# EAGLE design TurquoiseBicuspid (EAGLE 6.5.0)
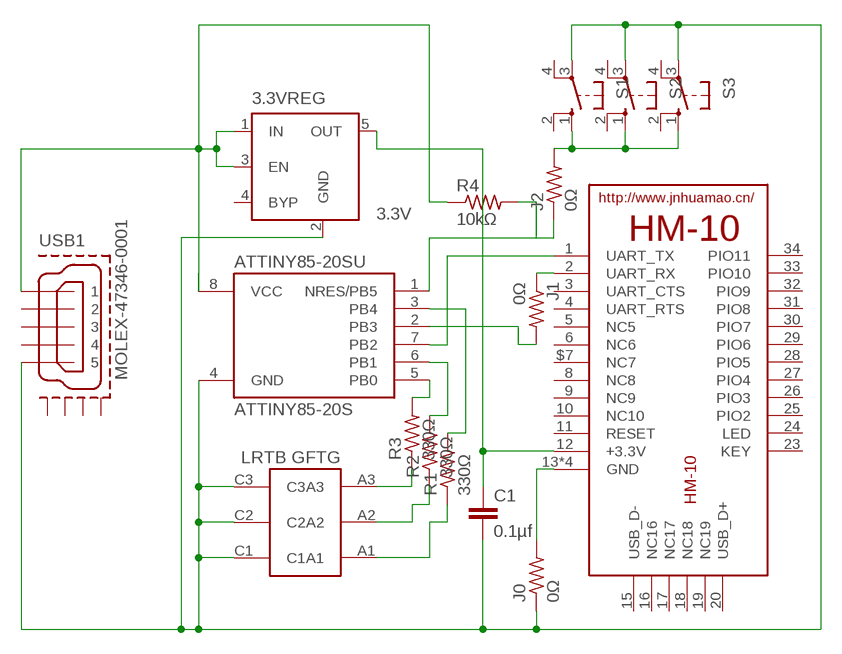
[diagram p0: schematic, sheet 1]

## Parts
3.3VREG  3.3V  MIC5219XX  [SOT23-5]
ATTINY85-20SU  ATTINY85-20S  [SOIC8_EIAJ_208MIL]
C1  0.1µf  C-EUC1206  [C1206]
HM-10  HM-10-BOARD  [26.9X13X2.2_BOARD]
J0  0Ω  R-US_R1206  [R1206]
J1  0Ω  R-US_R1206  [R1206]
J2  0Ω  R-US_R1206  [R1206]
R1  330Ω  R-US_M1206  [M1206]
R2  330Ω  R-US_M1206  [M1206]
R3  330Ω  R-US_M1206  [M1206]
R4  10kΩ  R-US_R1206  [R1206]
S1  10-XX  [B3F-10XX]
S2  10-XX  [B3F-10XX]
S3  10-XX  [B3F-10XX]
U$1  LRTB_GFTG  [LRTB_GFTG]
USB1  MOLEX-47346-0001  [MOLEX-47364-0001]

## Nets
3.3V: 3.3VREG.5(OUT) C1.1 HM-10.12(+3.3V)
5V: 3.3VREG.1(IN) 3.3VREG.3(EN) ATTINY85-20SU.8(VCC) R4.1 USB1.1
A1: ATTINY85-20SU.3(PB4) R1.1 R1.2 U$1.A1
A2: ATTINY85-20SU.6(PB1) R2.1 R2.2 U$1.A2
A3: ATTINY85-20SU.5(PB0) R3.1 R3.2 U$1.A3
BT_RX: ATTINY85-20SU.2(PB3) HM-10.2(UART_RX) J1.1 J1.2
BT_TX: ATTINY85-20SU.7(PB2) HM-10.1(UART_TX)
GND: 3.3VREG.2(GND) ATTINY85-20SU.4(GND) C1.2 J0.1 S1.3(P) S2.3(P) S3.3(P) U$1.C1 U$1.C2 U$1.C3 USB1.5
N$6: HM-10.13(GND) HM-10.14(GND) HM-10.21(GND) HM-10.22(GND) J0.2
RESET: ATTINY85-20SU.1(NRES/PB5) J2.1 J2.2 R4.2 S1.1(S) S2.1(S) S3.1(S)
Unconnected: 3.3VREG.4(BYP) HM-10.3(UART_CTS) HM-10.4(UART_RTS) HM-10.5(NC5) HM-10.6(NC6) HM-10.8(NC8) HM-10.9(NC9) HM-10.10(NC10) HM-10.11(RESET) HM-10.15(USB_D-) HM-10.16(NC16) HM-10.17(NC17) HM-10.18(NC18) HM-10.19(NC19) HM-10.20(USB_D+) HM-10.23(KEY) HM-10.24(LED) HM-10.25(PIO2) HM-10.26(PIO3) HM-10.27(PIO4) HM-10.28(PIO5) HM-10.29(PIO6) HM-10.30(PIO7) HM-10.31(PIO8) HM-10.32(PIO9) HM-10.33(PIO10) HM-10.34(PIO11) HM-10.$7(NC7) S1.2(S1) S1.4(P1) S2.2(S1) S2.4(P1) S3.2(S1) S3.4(P1) USB1.2 USB1.3 USB1.4 USB1.GND1 USB1.GND2 USB1.GND3 USB1.GND4

## Library data of the parts
3.3VREG = v-reg-micrel:MIC5219XX: VOLTAGE REGULATOR; OC_FARNELL: unknown; OC_NEWARK: unknown
ATTINY85-20SU = _hhn_attiny25_45_85:ATTINY85*: ATMEL ATtiny 85 Packages: P = PDIP 08 30mil S = SOIC 08 EIAJ 208mil Technologies Note: for complete ordering code (temp. range, finish, tape&reel etc.) see www.atmel.com • Supply Voltage: V = (1.8…5.5)V | [blank] = (2.7…5.5)V • Speed: 10 = 10 MHz | 20 = 20 MHz Author: Dipl.-Ing. FH Rainer Bayer HHN Hochschule Heilbronn (Heilbronn University), rainer.bayer@hs-heilbronn.de Ingenieurbüro ing-rb, mail@ing-rb.de
C1 = rcl:C-EU: CAPACITOR, European symbol
HM-10 = JNHuaMao:HM-10: HM Bluetooth module use TI CC2540 or CC2541, Master and slave roles in one, transmission version and remote control version and PIO state acquisition functions in one, Support the AT command modify module parameters, Convenient and flexible.
J0 J1 J2 R1-R4 = rcl:R-US_: RESISTOR, American symbol
S1-S3 = switch-omron:10-XX: OMRON SWITCH; MPN: B3F-1000; OC_FARNELL: 176432; OC_NEWARK: 36M3542
U$1 = osram_led:LRTB_GFTG
USB1 = usb_con-update:MOLEX-47346-0001: MICRO USB B, BOTTOM MOUNT

## Board
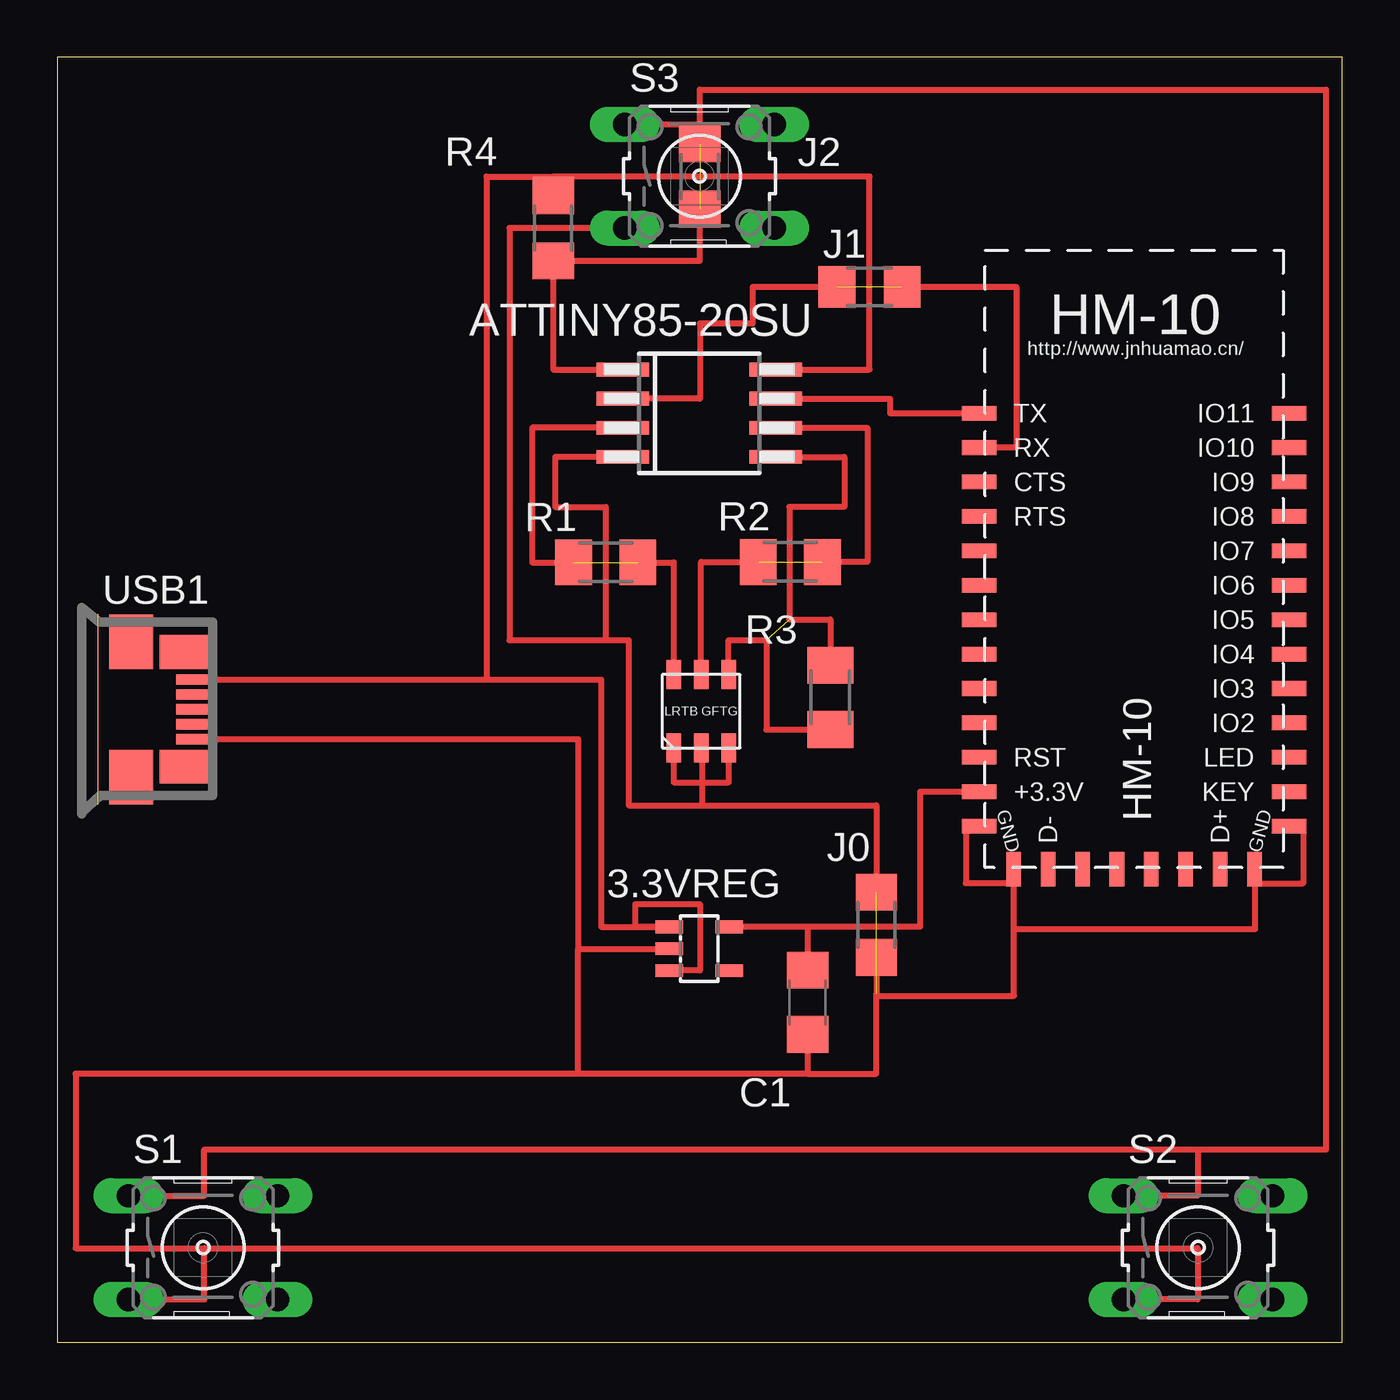
[diagram p1: board, top side]

Size 56 x 56 mm. Coordinates in mm from the lower left corner, seen from the top.
Outline: 0,0 56,0 56,56 0,56 0,0
Copper layers (1*16): Top 0.035mm / dielectric 1.5mm / Bottom 0.035mm
Design rules "default": minimum track width 10mil, minimum drill 24mil, track to track 8mil, track to pad 8mil, pad to pad 8mil, via to via 8mil, smd to smd 8mil, copper to edge 40mil, drill to drill 8mil, minimum pad ring 10mil, minimum via ring 8mil, stop-mask expansion 4mil, vias tented up to drill 0mil, thermal gap 10mil

### Footprints (pad centres in the part's own frame; a part is rotated, then mirrored left to right if it is on the bottom)
SOT23-5 = smd 0.55 x 1.2: 1 -0.95,-1.3; 2 0,-1.3; 3 0.95,-1.3; 4 0.95,1.3; 5 -0.95,1.3
SOIC8_EIAJ_208MIL = smd 0.6 x 2.286: 1 -1.905,-3.33; 2 -0.635,-3.33; 3 0.635,-3.33; 4 1.905,-3.33; 5 1.905,3.33; 6 0.635,3.33; 7 -0.635,3.33; 8 -1.905,3.33
C1206 = smd 1.6 x 1.8: 1 -1.4,0; 2 1.4,0
26.9X13X2.2_BOARD = smd 1.5 x 0.635: 1 -7.5,0; 2 -7.5,-1.5; 3 -7.5,-3; 4 -7.5,-4.5; 5 -7.5,-6; 6 -7.5,-7.5; 8 -7.5,-10.5; 9 -7.5,-12; 10 -7.5,-13.5; 11 -7.5,-15; 12 -7.5,-16.5; 13 -7.5,-18; 22 6,-18; 23 6,-16.5; 24 6,-15; 25 6,-13.5; 26 6,-12; 27 6,-10.5; 28 6,-9; 29 6,-7.5; 30 6,-6; 31 6,-4.5; 32 6,-3; 33 6,-1.5; 34 6,0; $7 -7.5,-9 | smd 0.635 x 1.5: 14 -6,-19.875; 15 -4.5,-19.875; 16 -3,-19.875; 17 -1.5,-19.875; 18 0,-19.875; 19 1.5,-19.875; 20 3,-19.875; 21 4.5,-19.875
R1206 = smd 1.6 x 1.803: 1 -1.422,0; 2 1.422,0
M1206 = smd 1.6 x 2: 1 -1.4,0; 2 1.4,0
B3F-10XX = drill 1.016 long: 1 -3.251,2.261; 2 3.251,2.261; 3 -3.251,-2.261; 4 3.251,-2.261
LRTB_GFTG = smd 0.635 x 1.27: A1 0.5,0; A2 1.7,0; A3 2.9,0; C1 0.5,-3.2; C2 1.7,-3.2; C3 2.9,-3.2
MOLEX-47364-0001 = smd 1.7 x 0.45: 1 2.8,1.3; 2 2.8,0.65; 3 2.8,0; 4 2.8,-0.65; 5 2.8,-1.3 | smd 1.9 x 2.375: GND1 0,2.95; GND4 0,-2.95 | smd 2.1 x 1.475: GND2 2.3,2.5; GND3 2.3,-2.5

### Placement (x,y rotation side)
3.3VREG  27.98,17.15 270 top
ATTINY85-20SU  27.98,40.49 270 top
C1  32.7,14.81 270 top
HM-10  47.68,40.49 0 top
J0  35.7,18.19 270 top
J1  35.4,46 180 top
J2  28,50.8 90 top
R1  23.9,33.99 180 top
R2  31.95,34.01 0 top
R3  33.69,28.1 90 top
R4  21.61,48.55 270 top
S1  6.35,4.12 0 top
S2  49.72,4.12 0 top
S3  27.99,50.82 0 top
U$1  26.36,29.1 0 top
USB1  3.22,27.58 0 top

### Tracks (layer width: path | path; a pad name or v marks a point on that pad's centre or on a via)
3.3V
  Top 0.254: 3.3VREG.5 32.7,18.1 32.7,18.11 | 32.7,18.11 C1.1 | HM-10.12 37.6,23.99 37.6,18.11 32.7,18.11
5V
  Top 0.254: USB1.1 18.7,28.88 | 18.7,28.88 23.7,28.88 23.7,18.1 3.3VREG.1 25.2,18.1 25.2,19.1 28,19.1 28,16.2 3.3VREG.3 | ATTINY85-20SU.8 35.4,42.4 35.4,50.8 21.7,50.8 21.61,50.8 | 18.7,28.88 18.7,50.8 21.61,50.8 | 21.61,50.8 R4.1
A1  (1 unrouted)
  Top 0.254: R1.1 26.86,33.99 U$1.A1 | ATTINY85-20SU.3 20.7,39.85 20.7,33.99 R1.2
A2  (1 unrouted)
  Top 0.254: ATTINY85-20SU.6 35.3,39.85 35.3,34.01 R2.2 | U$1.A2 28.06,34.01 R2.1
A3  (1 unrouted)
  Top 0.254: ATTINY85-20SU.5 34.3,38.59 34.3,36.4 31.9,36.4 31.9,31.5 33.69,31.5 R3.2 | U$1.A3 29.26,30.6 30.9,30.6 30.9,26.7 R3.1
BT_RX  (1 unrouted)
  Top 0.254: ATTINY85-20SU.2 28,41.12 28,44.4 30.3,44.4 30.3,46 J1.2 | J1.1 41.8,46 41.8,38.99 HM-10.2
BT_TX
  Top 0.254: ATTINY85-20SU.7 36.3,41.12 36.3,40.49 HM-10.1
GND  (2 unrouted)
  Top 0.254: S1.3 6.4,1.86 6.4,4.1 | 6.4,4.1 49.7,4.1 49.7,1.86 S2.3 | USB1.5 22.7,26.28 22.7,17.15 | 22.7,17.15 3.3VREG.2 | U$1.C1 26.86,24.4 29.26,24.4 U$1.C3 | U$1.C2 28.1,25.9 28.1,23.4 | ATTINY85-20SU.4 21.7,38.59 21.7,36.4 23.9,36.4 23.9,30.6 | 23.9,30.6 24.9,30.6 24.9,23.4 28.1,23.4 | S3.3 19.7,48.56 19.7,30.6 23.9,30.6 | 32.7,11.7 22.7,11.7 | 22.7,11.7 22.7,17.15 | 22.7,11.7 0.8,11.7 0.8,4.1 6.4,4.1 | 28.1,23.4 35.7,23.4 J0.1 | C1.2 32.7,11.7 | 32.7,11.7 35.7,11.7 35.7,15.2
N$6
  Top 0.254: HM-10.22 54.3,22.49 54.3,20 52.2,20 | HM-10.21 52.18,20 52.2,20 | HM-10.13 39.6,22.49 39.6,20 41.68,20 | HM-10.14 41.68,20 | 41.68,20 41.7,20 41.7,18 | 52.2,20 52.2,18 41.7,18 | J0.2 35.7,15.1 41.7,15.1 41.7,18
RESET  (1 unrouted)
  Top 0.254: ATTINY85-20SU.1 21.61,42.4 R4.2 28,47.13 J2.1 | S1.1 6.4,6.38 6.4,8.4 49.7,8.4 | 49.7,8.4 49.7,6.38 S2.1 | 49.7,8.4 55.3,8.4 55.3,54.6 28,54.6 J2.2 28,53.08 S3.1